# EAGLE schematic RGB-VIDEO (EAGLE 7.2.0)
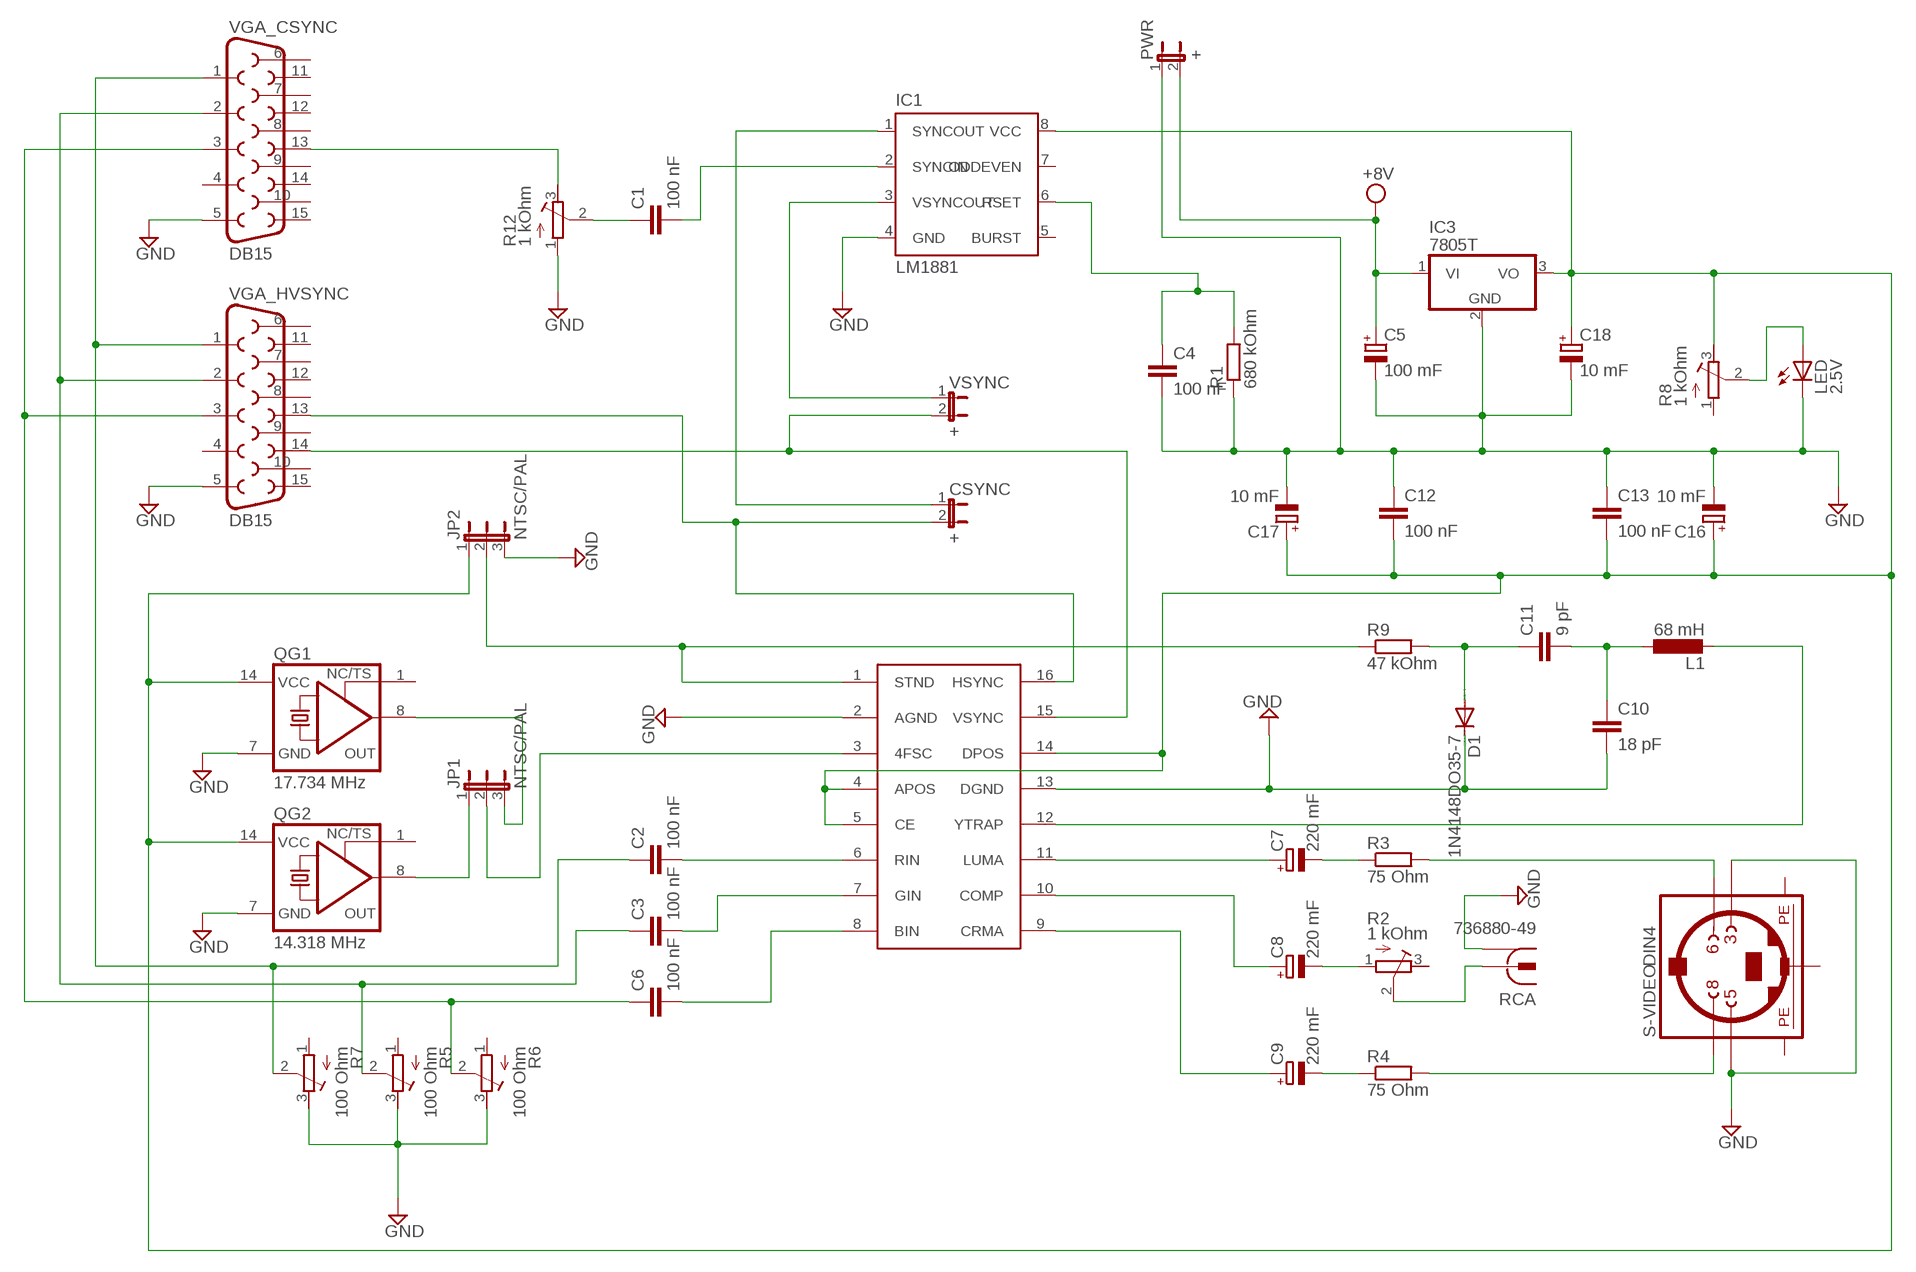
[diagram p0: schematic, sheet 1]

## Parts
C1  100 nF  C-EU050-025X075  [C050-025X075]
C2  100 nF  C-EU050-025X075  [C050-025X075]
C3  100 nF  C-EU050-025X075  [C050-025X075]
C4  100 nF  C-EU050-025X075  [C050-025X075]
C5  100 mF  CPOL-EUE3.5-10  [E3,5-10]
C6  100 nF  C-EU050-025X075  [C050-025X075]
C7  220 mF  CPOL-EUE3.5-10  [E3,5-10]
C8  220 mF  CPOL-EUE3.5-10  [E3,5-10]
C9  220 mF  CPOL-EUE3.5-10  [E3,5-10]
C10  18 pF  C-EU025-024X044  [C025-024X044]
C11  9 pF  C-EU025-024X044  [C025-024X044]
C12  100 nF  C-EU050-025X075  [C050-025X075]
C13  100 nF  C-EU050-025X075  [C050-025X075]
C16  10 mF  CPOL-EUE3.5-8  [E3,5-8]
C17  10 mF  CPOL-EUE3.5-8  [E3,5-8]
C18  10 mF  CPOL-EUE3.5-8  [E3,5-8]
CSYNC  +  JP1E  [JP1]
D1  1N4148DO35-7  [DO35-7]
IC1  LM1881  [DIL08]
IC2  AD725  [SO16W]
IC3  7805T  [TO220H]
JP1  NTSC/PAL  JP2E  [JP2]
JP2  NTSC/PAL  JP2E  [JP2]
L1  68 mH  L-EU6000-XXX-RC  [6000-XXXX-RC]
LED  2.5V  LED3MM  [LED3MM]
PWR  +  JP1E  [JP1]
QG1  17.734 MHz  XO-14  [DIL14S]
QG2  14.318 MHz  XO-14  [DIL14S]
R1  680 kOhm  R-EU_0204/7  [0204/7]
R2  1 kOhm  R-TRIMM3339P  [RTRIM3339P]
R3  75 Ohm  R-EU_0204/7  [0204/7]
R4  75 Ohm  R-EU_0204/7  [0204/7]
R5  100 Ohm  R-TRIMM3339P  [RTRIM3339P]
R6  100 Ohm  R-TRIMM3339P  [RTRIM3339P]
R7  100 Ohm  R-TRIMM3339P  [RTRIM3339P]
R8  1 kOhm  R-TRIMM3339P  [RTRIM3339P]
R9  47 kOhm  R-EU_0204/7  [0204/7]
R12  1 kOhm  R-TRIMM3339P  [RTRIM3339P]
RCA  736880-49  [736880-49]
S-VIDEO  DIN4  MINI_DIN_4  [M_DIN4]
VGA_CSYNC  DB15  [DB15]
VGA_HVSYNC  DB15  [DB15]
VSYNC  +  JP1E  [JP1]

## Nets
+5V: C12.2 C13.2 C16.+ C17.+ C18.+ IC1.8(VCC) IC2.4(APOS) IC2.5(CE) IC2.14(DPOS) IC3.3(VO) JP2.1 QG1.14(VCC) QG2.14(VCC) R8.3(E)
CSYNC: CSYNC.1 IC1.1(SYNCOUT)
GND: C4.2 C5.- C10.2 C12.1 C13.1 C16.- C17.- C18.- D1.C IC1.4(GND) IC2.2(AGND) IC2.13(DGND) IC3.2(GND) JP2.3 LED.K(C) PWR.1 QG1.7(GND) QG2.7(GND) R1.1 R5.3(E) R6.3(E) R7.3(E) R12.1(A) RCA.1 RCA.1@1 RCA.1@2 S-VIDEO.3 S-VIDEO.5 VGA_CSYNC.5 VGA_HVSYNC.5
HSYNC: CSYNC.2 IC2.16(HSYNC) VGA_HVSYNC.13
N$1: C4.1 IC1.6(RSET) R1.2
N$2: C1.2 IC1.2(SYNCIN)
N$4: LED.A R8.2(S)
N$5: JP1.1 QG2.8(OUT)
N$6: JP1.3 QG1.8(OUT)
N$7: IC2.3(4FSC) JP1.2
N$8: C2.2 IC2.6(RIN)
N$9: C3.2 IC2.7(GIN)
N$10: C6.2 IC2.8(BIN)
N$11: C2.1 R7.2(S) VGA_CSYNC.1 VGA_HVSYNC.1
N$12: C3.1 R5.2(S) VGA_CSYNC.2 VGA_HVSYNC.2
N$13: C6.1 R6.2(S) VGA_CSYNC.3 VGA_HVSYNC.3
N$14: C8.- R2.1(A)
N$15: R2.2(S) RCA.2
N$16: C7.- R3.1
N$17: R3.2 S-VIDEO.6
N$18: C7.+ IC2.11(LUMA)
N$19: C8.+ IC2.10(COMP)
N$20: C9.+ IC2.9(CRMA)
N$21: C9.- R4.1
N$22: R4.2 S-VIDEO.8
N$23: C11.1 D1.A R9.2
N$24: C10.1 C11.2 L1.1
N$25: IC2.12(YTRAP) L1.2
N$26: IC1.3(VSYNCOUT) VSYNC.1
N$28: C1.1 R12.2(S)
STND: IC2.1(STND) JP2.2 R9.1
VCC: C5.+ IC3.1(VI) PWR.2 ; supply symbol labelled +8V
VGA_CSYNC: R12.3(E) VGA_CSYNC.13
VSYNC: IC2.15(VSYNC) VGA_HVSYNC.14 VSYNC.2
Unconnected: IC1.5(BURST) IC1.7(ODDEVEN) QG1.1(TS) QG2.1(TS) R2.3(E) R5.1(A) R6.1(A) R7.1(A) R8.1(A) VGA_CSYNC.4 VGA_CSYNC.6 VGA_CSYNC.7 VGA_CSYNC.8 VGA_CSYNC.9 VGA_CSYNC.10 VGA_CSYNC.11 VGA_CSYNC.12 VGA_CSYNC.14 VGA_CSYNC.15 VGA_HVSYNC.4 VGA_HVSYNC.6 VGA_HVSYNC.7 VGA_HVSYNC.8 VGA_HVSYNC.9 VGA_HVSYNC.10 VGA_HVSYNC.11 VGA_HVSYNC.12 VGA_HVSYNC.15

## Power pins joined to a net without a drawn wire
PE1: S-VIDEO.SH1(PE1)
PE2: S-VIDEO.SH2(PE2)
PE3: S-VIDEO.SH3(PE3)

## Library data of the parts
C1-C4 C6 C10-C13 = rcl:C-EU: CAPACITOR, European symbol
C5 C7-C9 C16-C18 = rcl:CPOL-EU: POLARIZED CAPACITOR, European symbol
CSYNC PWR VSYNC = jumper:JP1E: JUMPER
D1 = diode:1N4148: DIODE high speed (Philips)
IC1 = lm1881:LM1881
IC2 = ad725:AD725
IC3 = linear:78*: Positive VOLTAGE REGULATOR Source: http://cache.national.com/ds/LM/LM78L05.pdf http://www.fairchildsemi.com/ds/LM/LM7805.pdf
JP1 JP2 = jumper:JP2E: JUMPER
L1 = rcl:L-EU: INDUCTOR, European symbol
LED = led:LED: LED OSRAM: - CHIPLED LG R971, LG N971, LY N971, LG Q971, LY Q971, LO R971, LY R971 LH N974, LH R974 LS Q976, LO Q976, LY Q976 LO Q996 - Hyper CHIPLED LW Q18S LB Q993, LB Q99A, LB R99A - SideLED LS A670, LO A670, LY A670, LG A670, LP A670 LB A673, LV A673, LT A673, LW A673 LH A674 LY A675 LS A676, LA A676, LO A676, LY A676, LW A676 LS A679, LY A679, LG A679 - Hyper Micro SIDELED® LS Y876, LA Y876, LO Y876, LY Y876 LT Y87S - SmartLED LW L88C, LW L88S LB L89C, LB L89S, LG L890 LS L89K, LO L89K, LY L89K LS L896, LA L896, LO L896, LY L896 - TOPLED LS T670, LO T670, LY T670, LG T670, LP T670 LSG T670, LSP T670, LSY T670, LOP T670, LYG T670 LG T671, LOG T671, LSG T671 LB T673, LV T673, LT T673, LW T673 LH T674 LS T676, LA T676, LO T676, LY T676, LB T676, LH T676, LSB T676, LW T676 LB T67C, LV T67C, LT T67C, LS T67K, LO T67K, LY T67K, LW E67C LS E67B, LA E67B, LO E67B, LY E67B, LB E67C, LV E67C, LT E67C LW T67C LS T679, LY T679, LG T679 LS T770, LO T770, LY T770, LG T770, LP T770 LB T773, LV T773, LT T773, LW T773 LH T774 LS E675, LA E675, LY E675, LS T675 LS T776, LA T776, LO T776, LY T776, LB T776 LHGB T686 LT T68C, LB T68C - Hyper Mini TOPLED® LB M676 - Mini TOPLED Santana® LG M470 LS M47K, LO M47K, LY M47K Source: http://www.osram.convergy.de LUXEON: - LUMILED® LXK2-PW12-R00, LXK2-PW12-S00, LXK2-PW14-U00, LXK2-PW14-V00 LXK2-PM12-R00, LXK2-PM12-S00, LXK2-PM14-U00 LXK2-PE12-Q00, LXK2-PE12-R00, LXK2-PE12-S00, LXK2-PE14-T00, LXK2-PE14-U00 LXK2-PB12-K00, LXK2-PB12-L00, LXK2-PB12-M00, LXK2-PB14-N00, LXK2-PB14-P00, LXK2-PB14-Q00 LXK2-PR12-L00, LXK2-PR12-M00, LXK2-PR14-Q00, LXK2-PR14-R00 LXK2-PD12-Q00, LXK2-PD12-R00, LXK2-PD12-S00 LXK2-PH12-R00, LXK2-PH12-S00 LXK2-PL12-P00, LXK2-PL12-Q00, LXK2-PL12-R00 Source: www.luxeon.com KINGBRIGHT: KA-3528ASYC Source: www.kingbright.com
QG1 QG2 = crystal:XO-: CRYSTAL; OC_FARNELL: unknown; OC_NEWARK: unknown
R1 R3 R4 R9 = resistor:R-EU_: RESISTOR, European symbol
R2 R5-R8 R12 = resistor:R-TRIMM: Trimm resistor
RCA = con-conrad:736880-49: Cinch Connector ( RCA Jack ) Cinch-Einbaukupplung 90º 72345 Vernickelt BKL Electronic Source: Conrad <http://www.conrad.de/ce/de/product/736880>
S-VIDEO = mini_din:MINI_DIN_4
VGA_CSYNC VGA_HVSYNC = SparkFun-Connectors:DB15: DB15 / VGA right angle through-hole female connector.